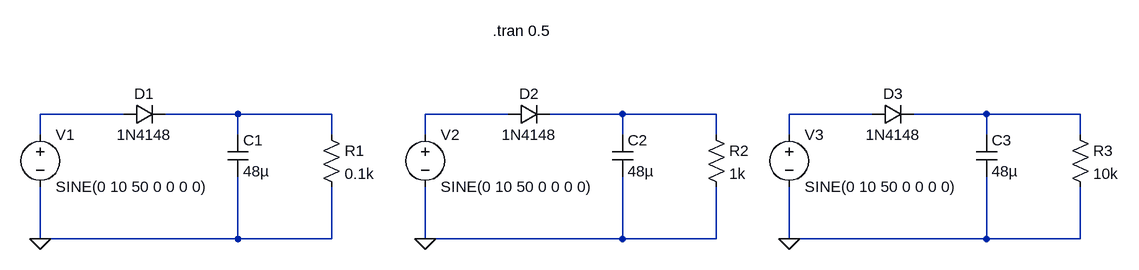
[diagram p0: schematic Problema3.asc]
Problema3.asc, the LTspice schematic file:
Version 4.1
SHEET 1 1208 680
WIRE -400 384 -528 384
WIRE -224 384 -336 384
WIRE -80 384 -224 384
WIRE 192 384 64 384
WIRE 368 384 256 384
WIRE 512 384 368 384
WIRE 752 384 624 384
WIRE 928 384 816 384
WIRE 1072 384 928 384
WIRE -528 416 -528 384
WIRE -224 416 -224 384
WIRE -80 416 -80 384
WIRE 64 416 64 384
WIRE 368 416 368 384
WIRE 512 416 512 384
WIRE 624 416 624 384
WIRE 928 416 928 384
WIRE 1072 416 1072 384
WIRE -528 576 -528 496
WIRE -224 576 -224 480
WIRE -224 576 -528 576
WIRE -80 576 -80 496
WIRE -80 576 -224 576
WIRE 64 576 64 496
WIRE 368 576 368 480
WIRE 368 576 64 576
WIRE 512 576 512 496
WIRE 512 576 368 576
WIRE 624 576 624 496
WIRE 928 576 928 480
WIRE 928 576 624 576
WIRE 1072 576 1072 496
WIRE 1072 576 928 576
FLAG -528 576 0
FLAG 64 576 0
FLAG 624 576 0
SYMBOL voltage -528 400 R0
WINDOW 123 0 0 Left 0
WINDOW 39 0 0 Left 0
SYMATTR InstName V1
SYMATTR Value SINE(0 10 50 0 0 0 0)
SYMBOL diode -400 400 R270
WINDOW 0 32 32 VTop 2
WINDOW 3 0 32 VBottom 2
SYMATTR InstName D1
SYMATTR Value 1N4148
SYMBOL cap -240 416 R0
SYMATTR InstName C1
SYMATTR Value 48µ
SYMBOL res -96 400 R0
SYMATTR InstName R1
SYMATTR Value 0.1k
SYMBOL voltage 64 400 R0
WINDOW 123 0 0 Left 0
WINDOW 39 0 0 Left 0
SYMATTR InstName V2
SYMATTR Value SINE(0 10 50 0 0 0 0)
SYMBOL diode 192 400 R270
WINDOW 0 32 32 VTop 2
WINDOW 3 0 32 VBottom 2
SYMATTR InstName D2
SYMATTR Value 1N4148
SYMBOL cap 352 416 R0
SYMATTR InstName C2
SYMATTR Value 48µ
SYMBOL res 496 400 R0
SYMATTR InstName R2
SYMATTR Value 1k
SYMBOL voltage 624 400 R0
WINDOW 123 0 0 Left 0
WINDOW 39 0 0 Left 0
SYMATTR InstName V3
SYMATTR Value SINE(0 10 50 0 0 0 0)
SYMBOL diode 752 400 R270
WINDOW 0 32 32 VTop 2
WINDOW 3 0 32 VBottom 2
SYMATTR InstName D3
SYMATTR Value 1N4148
SYMBOL cap 912 416 R0
SYMATTR InstName C3
SYMATTR Value 48µ
SYMBOL res 1056 400 R0
SYMATTR InstName R3
SYMATTR Value 10k
TEXT 168 256 Left 2 !.tran 0.5

The netlist it stands for:
* Problema3.asc
V1 N001 0 SINE(0 10 50 0 0 0 0)
D1 N001 N002 1N4148
C1 N002 0 48µ
R1 N002 0 0.1k
V2 N003 0 SINE(0 10 50 0 0 0 0)
D2 N003 N004 1N4148
C2 N004 0 48µ
R2 N004 0 1k
V3 N005 0 SINE(0 10 50 0 0 0 0)
D3 N005 N006 1N4148
C3 N006 0 48µ
R3 N006 0 10k
.model D D
.lib standard.dio
.tran 0.5
.backanno
.end